# Altium schematic sheet QCopterRC_MAIN_Sch.SchDoc
size A4
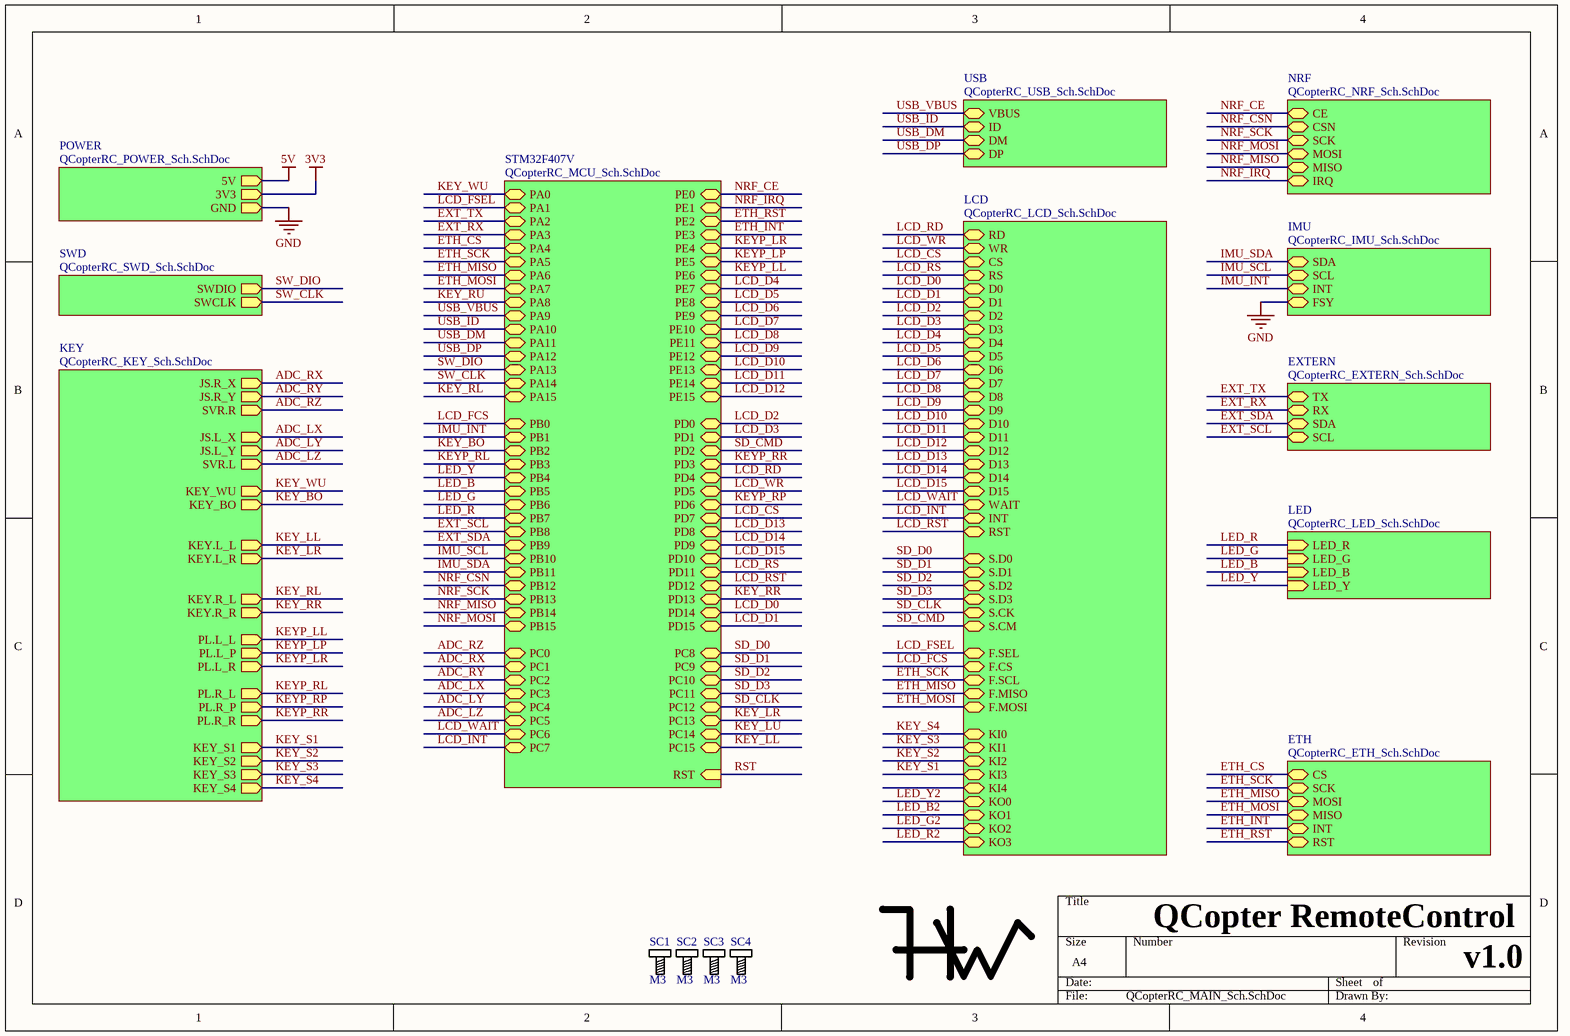
[diagram p0: QCopterRC_MAIN_Sch.SchDoc]

## Parts
HW1  HW  [Logo_HW]  (value not drawn)
SC1  M3  [SCRREW_M3]
SC2  M3  [SCRREW_M3]
SC3  M3  [SCRREW_M3]
SC4  M3  [SCRREW_M3]

## Sub-sheets
ETH = QCopterRC_ETH_Sch.SchDoc: MISO, MOSI, SCK, CS, INT, RST
EXTERN = QCopterRC_EXTERN_Sch.SchDoc: SDA, SCL, TX, RX
IMU = QCopterRC_IMU_Sch.SchDoc: SCL, SDA, FSY, INT
KEY = QCopterRC_KEY_Sch.SchDoc: KEY_WU (out), KEY_BO (out), JS.R_Y (out), JS.R_X (out), JS.L_X (out), JS.L_Y (out), SVR.R (out), SVR.L (out), KEY.L_L (out), KEY.L_R (out), KEY.R_L (out), KEY.R_R (out), PL.L_L (out), PL.L_P (out), PL.L_R (out), PL.R_R (out), PL.R_P (out), PL.R_L (out), KEY_S1 (out), KEY_S2 (out), KEY_S3 (out), KEY_S4 (out)
LCD = QCopterRC_LCD_Sch.SchDoc: RS, CS, WR, RD, RST, D0, D1, D2, D3, D4, D5, D6, D7, D8, D9, D10, D11, D12, D13, D14, D15, WAIT, INT, S.D0, S.CK, S.CM, S.D1, S.D2, S.D3, F.CS, F.SCL, F.MISO, F.MOSI, F.SEL, KI0, KI1, KI2, KI3, KI4, KO0, KO1, KO2, KO3
LED = QCopterRC_LED_Sch.SchDoc: LED_R (in), LED_G (in), LED_B (in), LED_Y (in)
NRF = QCopterRC_NRF_Sch.SchDoc: MISO, MOSI, SCK, CSN, CE, IRQ
POWER = QCopterRC_POWER_Sch.SchDoc: 3V3 (out), 5V (out), GND (out)
STM32F407V = QCopterRC_MCU_Sch.SchDoc: PA0, PA1, PA2, PA3, PA4, PA5, PA6, PA7, PA8, PA9, PA10, PA11, PA12, PA13, PA14, PA15, PB0, PB1, PB2, PB3, PB4, PB5, PB6, PB7, PB8, PB9, PB10, PB11, PB12, PB13, PB14, PB15, PC0, PC1, PC2, PC3, PC4, PC5, PC6, PC7, PC8, PC9, PC10, PC11, PC12, PC13, PC14, PC15, PD0, PD1, PD2, PD3, PD4, PD5, PD6, PD7, PD8, PD9, PD10, PD11, PD12, PD13, PD14, PD15, RST (in), PE0, PE1, PE2, PE3, PE4, PE5, PE6, PE7, PE8, PE9, PE10, PE11, PE12, PE13, PE14, PE15
SWD = QCopterRC_SWD_Sch.SchDoc: SWDIO (out), SWCLK (out)
USB = QCopterRC_USB_Sch.SchDoc: VBUS, ID, DM, DP

## Nets
3V3: sheet POWER/3V3
5V: sheet POWER/5V
GND: sheet POWER/GND, sheet IMU/FSY
ADC_LX: sheet STM32F407V/PC3, sheet KEY/JS.L_X
ADC_LY: sheet STM32F407V/PC4, sheet KEY/JS.L_Y
ADC_LZ: sheet STM32F407V/PC5, sheet KEY/SVR.L
ADC_RX: sheet STM32F407V/PC1, sheet KEY/JS.R_X
ADC_RY: sheet STM32F407V/PC2, sheet KEY/JS.R_Y
ADC_RZ: sheet STM32F407V/PC0, sheet KEY/SVR.R
ETH_CS: sheet STM32F407V/PA4, sheet ETH/CS
ETH_INT: sheet STM32F407V/PE3, sheet ETH/INT
ETH_MISO: sheet STM32F407V/PA6, sheet LCD/F.MISO, sheet ETH/MOSI
ETH_MOSI: sheet STM32F407V/PA7, sheet LCD/F.MOSI, sheet ETH/MISO
ETH_RST: sheet STM32F407V/PE2, sheet ETH/RST
ETH_SCK: sheet STM32F407V/PA5, sheet LCD/F.SCL, sheet ETH/SCK
EXT_RX: sheet STM32F407V/PA3, sheet EXTERN/RX
EXT_SCL: sheet STM32F407V/PB8, sheet EXTERN/SCL
EXT_SDA: sheet STM32F407V/PB9, sheet EXTERN/SDA
EXT_TX: sheet STM32F407V/PA2, sheet EXTERN/TX
IMU_INT: sheet STM32F407V/PB1, sheet IMU/INT
IMU_SCL: sheet STM32F407V/PB10, sheet IMU/SCL
IMU_SDA: sheet STM32F407V/PB11, sheet IMU/SDA
KEY_BO: sheet STM32F407V/PB2, sheet KEY/KEY_BO
KEY_LL: sheet STM32F407V/PC15, sheet KEY/KEY.L_L
KEY_LR: sheet STM32F407V/PC13, sheet KEY/KEY.L_R
KEY_LU: sheet STM32F407V/PC14
KEY_RL: sheet STM32F407V/PA15, sheet KEY/KEY.R_L
KEY_RR: sheet STM32F407V/PD13, sheet KEY/KEY.R_R
KEY_RU: sheet STM32F407V/PA8
KEY_S1: sheet LCD/KI3, sheet KEY/KEY_S1
KEY_S2: sheet LCD/KI2, sheet KEY/KEY_S2
KEY_S3: sheet LCD/KI1, sheet KEY/KEY_S3
KEY_S4: sheet LCD/KI0, sheet KEY/KEY_S4
KEY_WU: sheet STM32F407V/PA0, sheet KEY/KEY_WU
KEYP_LL: sheet STM32F407V/PE6, sheet KEY/PL.L_L
KEYP_LP: sheet STM32F407V/PE5, sheet KEY/PL.L_P
KEYP_LR: sheet STM32F407V/PE4, sheet KEY/PL.L_R
KEYP_RL: sheet STM32F407V/PB3, sheet KEY/PL.R_L
KEYP_RP: sheet STM32F407V/PD6, sheet KEY/PL.R_P
KEYP_RR: sheet STM32F407V/PD3, sheet KEY/PL.R_R
LCD_CS: sheet STM32F407V/PD7, sheet LCD/CS
LCD_D0: sheet STM32F407V/PD14, sheet LCD/D0
LCD_D1: sheet STM32F407V/PD15, sheet LCD/D1
LCD_D2: sheet STM32F407V/PD0, sheet LCD/D2
LCD_D3: sheet STM32F407V/PD1, sheet LCD/D3
LCD_D4: sheet STM32F407V/PE7, sheet LCD/D4
LCD_D5: sheet STM32F407V/PE8, sheet LCD/D5
LCD_D6: sheet STM32F407V/PE9, sheet LCD/D6
LCD_D7: sheet STM32F407V/PE10, sheet LCD/D7
LCD_D8: sheet STM32F407V/PE11, sheet LCD/D8
LCD_D9: sheet STM32F407V/PE12, sheet LCD/D9
LCD_D10: sheet STM32F407V/PE13, sheet LCD/D10
LCD_D11: sheet STM32F407V/PE14, sheet LCD/D11
LCD_D12: sheet STM32F407V/PE15, sheet LCD/D12
LCD_D13: sheet STM32F407V/PD8, sheet LCD/D13
LCD_D14: sheet STM32F407V/PD9, sheet LCD/D14
LCD_D15: sheet STM32F407V/PD10, sheet LCD/D15
LCD_FCS: sheet STM32F407V/PB0, sheet LCD/F.CS
LCD_FSEL: sheet STM32F407V/PA1, sheet LCD/F.SEL
LCD_INT: sheet STM32F407V/PC7, sheet LCD/INT
LCD_RD: sheet STM32F407V/PD4, sheet LCD/RD
LCD_RS: sheet STM32F407V/PD11, sheet LCD/RS
LCD_RST: sheet STM32F407V/PD12, sheet LCD/RST
LCD_WAIT: sheet STM32F407V/PC6, sheet LCD/WAIT
LCD_WR: sheet STM32F407V/PD5, sheet LCD/WR
LED_B: sheet LED/LED_B, sheet STM32F407V/PB5
LED_B2: sheet LCD/KO1
LED_G: sheet LED/LED_G, sheet STM32F407V/PB6
LED_G2: sheet LCD/KO2
LED_R: sheet LED/LED_R, sheet STM32F407V/PB7
LED_R2: sheet LCD/KO3
LED_Y: sheet LED/LED_Y, sheet STM32F407V/PB4
LED_Y2: sheet LCD/KO0
NRF_CE: sheet STM32F407V/PE0, sheet NRF/CE
NRF_CSN: sheet STM32F407V/PB12, sheet NRF/CSN
NRF_IRQ: sheet STM32F407V/PE1, sheet NRF/IRQ
NRF_MISO: sheet STM32F407V/PB14, sheet NRF/MISO
NRF_MOSI: sheet STM32F407V/PB15, sheet NRF/MOSI
NRF_SCK: sheet STM32F407V/PB13, sheet NRF/SCK
RST: sheet STM32F407V/RST
SD_CLK: sheet STM32F407V/PC12, sheet LCD/S.CK
SD_CMD: sheet STM32F407V/PD2, sheet LCD/S.CM
SD_D0: sheet STM32F407V/PC8, sheet LCD/S.D0
SD_D1: sheet STM32F407V/PC9, sheet LCD/S.D1
SD_D2: sheet STM32F407V/PC10, sheet LCD/S.D2
SD_D3: sheet STM32F407V/PC11, sheet LCD/S.D3
SW_CLK: sheet SWD/SWCLK, sheet STM32F407V/PA14
SW_DIO: sheet SWD/SWDIO, sheet STM32F407V/PA13
USB_DM: sheet STM32F407V/PA11, sheet USB/DM
USB_DP: sheet STM32F407V/PA12, sheet USB/DP
USB_ID: sheet STM32F407V/PA10, sheet USB/ID
USB_VBUS: sheet STM32F407V/PA9, sheet USB/VBUS

## Notes on the sheet
- QCopter RemoteControl
- v1.0

## Library data of the parts
HW1 = HW: Logo
SC1-SC4 = Screw_M3: Screw